# Altium schematic sheet EDLC_DC_DC.SchDoc
size A3; SheetNumber: 2; SheetTotal: 5
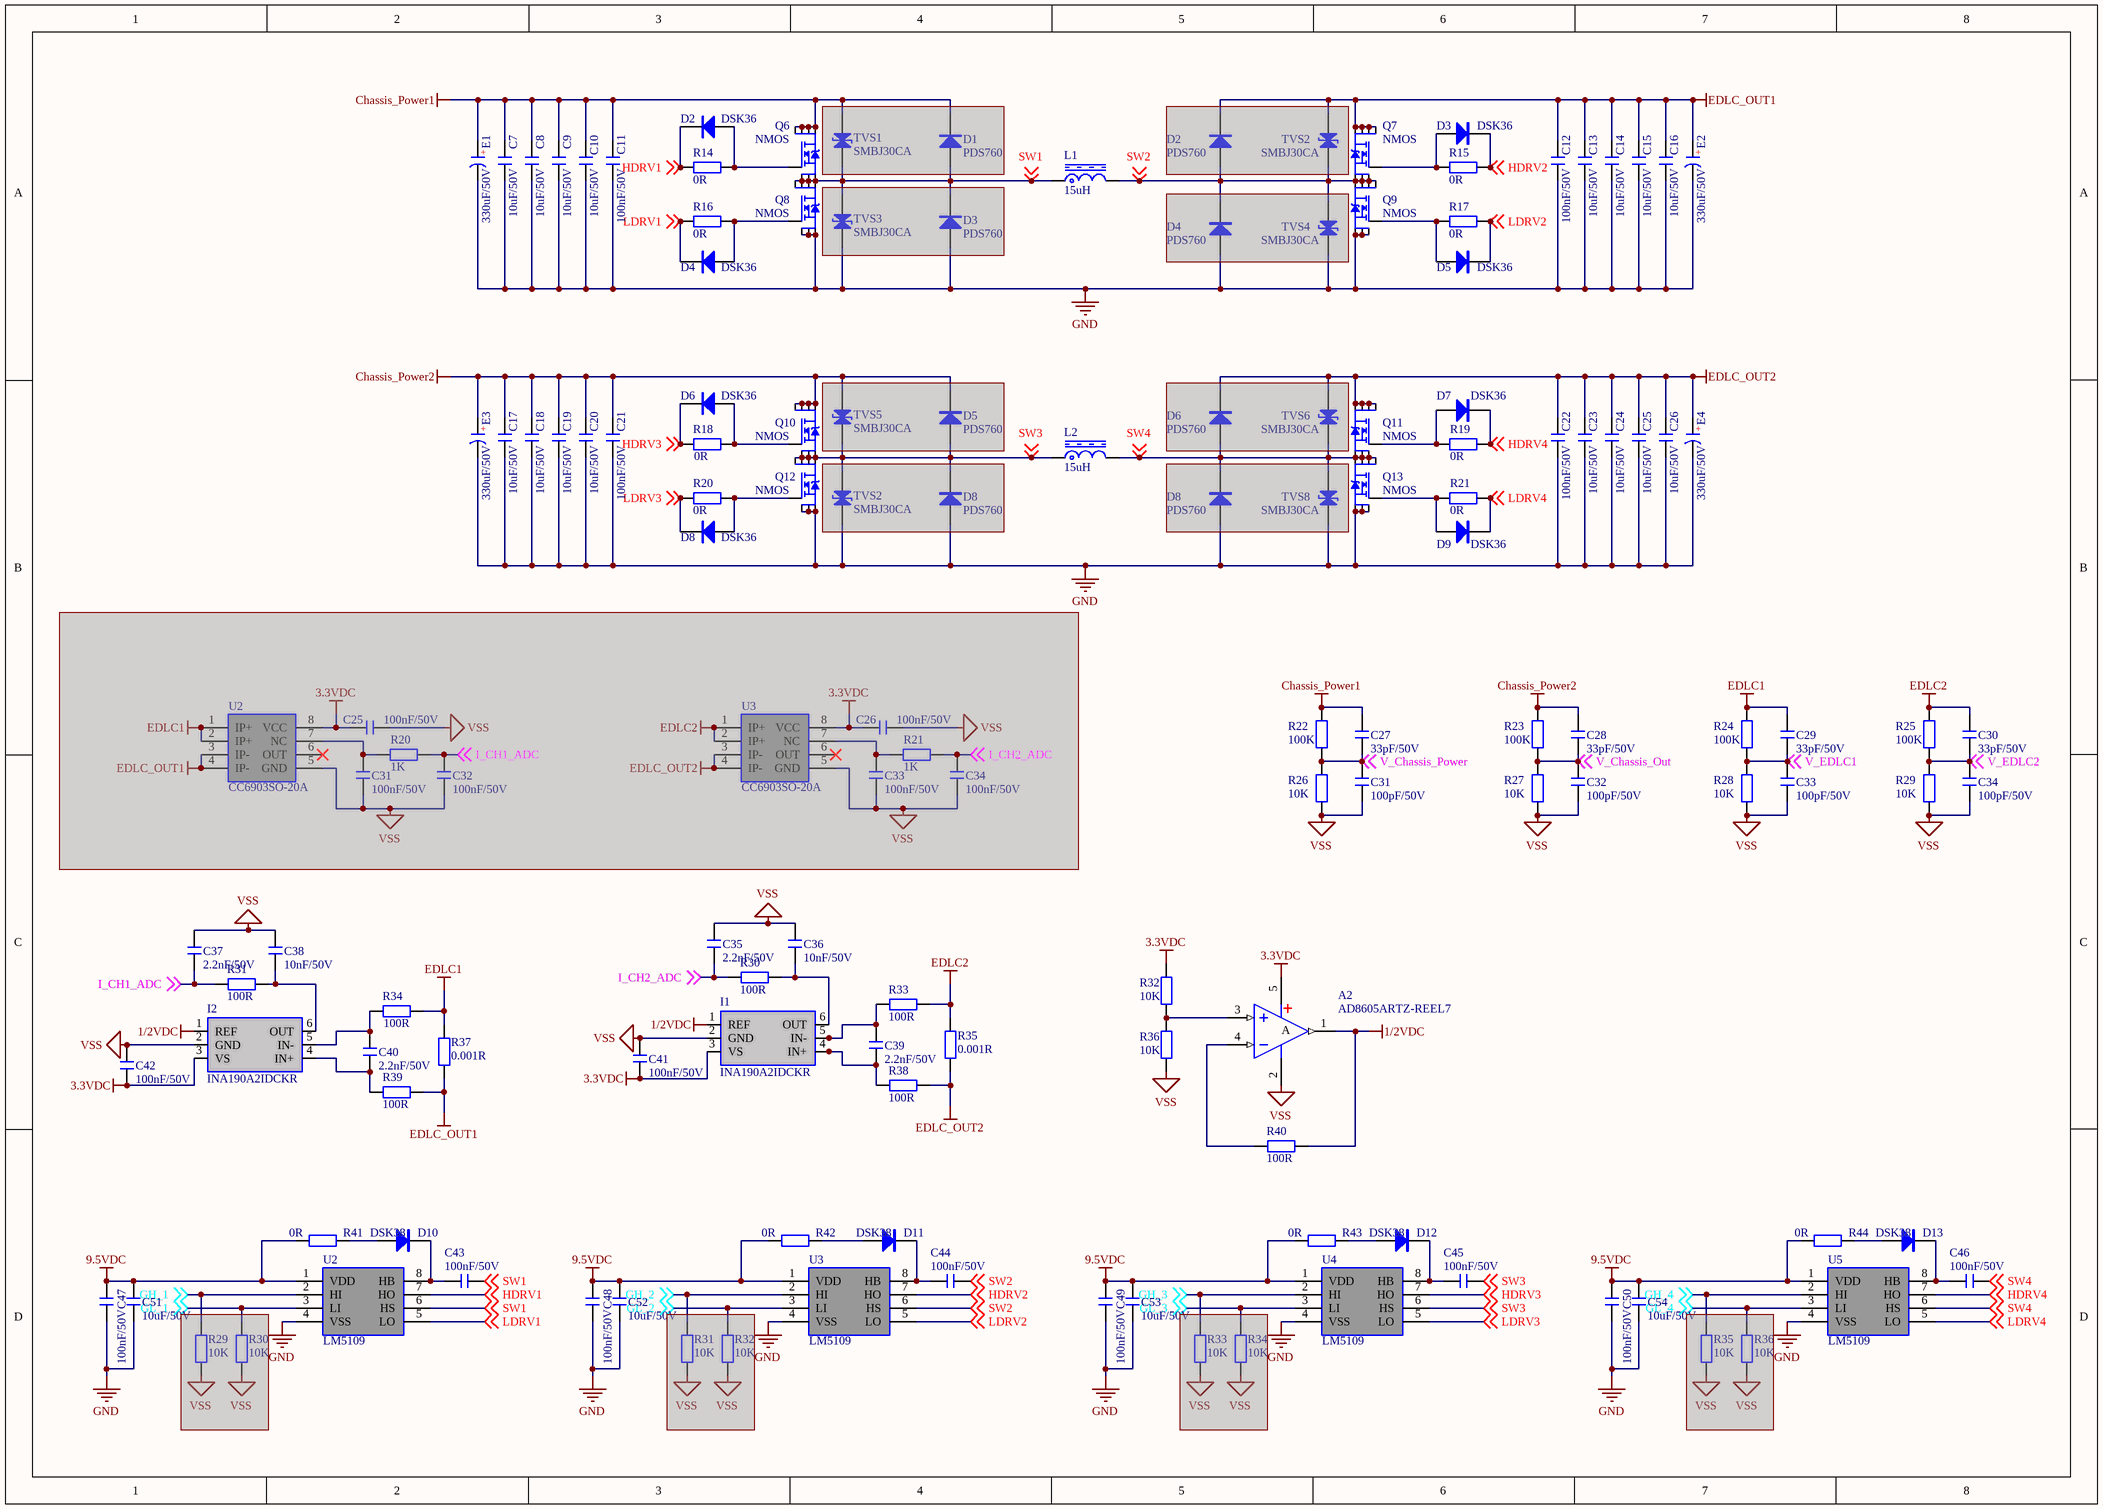
[diagram p0: EDLC_DC_DC.SchDoc]

## Parts
(Parts that share a designator on the sheet are numbered #1, #2 ... from top to bottom, then left to right.)
A2  AD8605ARTZ-REEL7  [SOT23-5N]
C7  10uF/50V  [C 1206_L]
C8  10uF/50V  [C 1206_L]
C9  10uF/50V  [C 1206_L]
C10  10uF/50V  [C 1206_L]
C11  100nF/50V  [C 0603_L]
C12  100nF/50V  [C 0603_L]
C13  10uF/50V  [C 1206_L]
C14  10uF/50V  [C 1206_L]
C15  10uF/50V  [C 1206_L]
C16  10uF/50V  [C 1206_L]
C17  10uF/50V  [C 1206_L]
C18  10uF/50V  [C 1206_L]
C19  10uF/50V  [C 1206_L]
C20  10uF/50V  [C 1206_L]
C21  100nF/50V  [C 0603_L]
C22  100nF/50V  [C 0603_L]
C23  10uF/50V  [C 1206_L]
C24  10uF/50V  [C 1206_L]
C25#1  10uF/50V  [C 1206_L]
C25#2  100nF/50V  [C 0603_L]  (masked out: inside a compile mask, not in the netlist)
C26#1  10uF/50V  [C 1206_L]
C26#2  100nF/50V  [C 0603_L]  (masked out: inside a compile mask, not in the netlist)
C27  33pF/50V  [C 0603_L]
C28  33pF/50V  [C 0603_L]
C29  33pF/50V  [C 0603_L]
C30  33pF/50V  [C 0603_L]
C31#1  100nF/50V  [C 0603_L]  (masked out: inside a compile mask, not in the netlist)
C31#2  100pF/50V  [C 0603_L]
C32#1  100nF/50V  [C 0603_L]  (masked out: inside a compile mask, not in the netlist)
C32#2  100pF/50V  [C 0603_L]
C33#1  100nF/50V  [C 0603_L]  (masked out: inside a compile mask, not in the netlist)
C33#2  100pF/50V  [C 0603_L]
C34#1  100nF/50V  [C 0603_L]  (masked out: inside a compile mask, not in the netlist)
C34#2  100pF/50V  [C 0603_L]
C35  2.2nF/50V  [C 0603_L]
C36  10nF/50V  [C 0603_L]
C37  2.2nF/50V  [C 0603_L]
C38  10nF/50V  [C 0603_L]
C39  2.2nF/50V  [C 0603_L]
C40  2.2nF/50V  [C 0603_L]
C41  100nF/50V  [C 0603_L]
C42  100nF/50V  [C 0603_L]
C43  100nF/50V  [C 0603_L]
C44  100nF/50V  [C 0603_L]
C45  100nF/50V  [C 0603_L]
C46  100nF/50V  [C 0603_L]
C47  100nF/50V  [C 0603_L]
C48  100nF/50V  [C 0603_L]
C49  100nF/50V  [C 0603_L]
C50  100nF/50V  [C 0603_L]
C51  10uF/50V  [C 1206_L]
C52  10uF/50V  [C 1206_L]
C53  10uF/50V  [C 1206_L]
C54  10uF/50V  [C 1206_L]
D1  PDS760  [SMPC]  (masked out: inside a compile mask, not in the netlist)
D2#1  DSK36  [SOD-323]
D2#2  PDS760  [SMPC]  (masked out: inside a compile mask, not in the netlist)
D3#1  DSK36  [SOD-323]
D3#2  PDS760  [SMPC]  (masked out: inside a compile mask, not in the netlist)
D4#1  PDS760  [SMPC]  (masked out: inside a compile mask, not in the netlist)
D4#2  DSK36  [SOD-323]
D5#1  DSK36  [SOD-323]
D5#2  PDS760  [SMPC]  (masked out: inside a compile mask, not in the netlist)
D6#1  DSK36  [SOD-323]
D6#2  PDS760  [SMPC]  (masked out: inside a compile mask, not in the netlist)
D7  DSK36  [SOD-323]
D8#1  PDS760  [SMPC]  (masked out: inside a compile mask, not in the netlist)
D8#2  PDS760  [SMPC]  (masked out: inside a compile mask, not in the netlist)
D8#3  DSK36  [SOD-323]
D9  DSK36  [SOD-323]
D10  DSK38  [SOD-123F]
D11  DSK38  [SOD-123F]
D12  DSK38  [SOD-123F]
D13  DSK38  [SOD-123F]
E1  330uF/50V  [CS 5.0*10*13 - R]
E2  330uF/50V  [CS 5.0*10*13 - R]
E3  330uF/50V  [CS 5.0*10*13 - R]
E4  330uF/50V  [CS 5.0*10*13 - R]
I1  INA190A2IDCKR  [SC-70-6]
I2  INA190A2IDCKR  [SC-70-6]
L1  15uH  [CKST2020-1717]
L2  15uH  [CKST2020-1717]
Q6  NMOS  [DFN5*6-8L]
Q7  NMOS  [DFN5*6-8L]
Q8  NMOS  [DFN5*6-8L]
Q9  NMOS  [DFN5*6-8L]
Q10  NMOS  [DFN5*6-8L]
Q11  NMOS  [DFN5*6-8L]
Q12  NMOS  [DFN5*6-8L]
Q13  NMOS  [DFN5*6-8L]
R14  0R  [R 0603_L]
R15  0R  [R 0603_L]
R16  0R  [R 0603_L]
R17  0R  [R 0603_L]
R18  0R  [R 0603_L]
R19  0R  [R 0603_L]
R20#1  0R  [R 0603_L]
R20#2  1K  [R 0603_L]  (masked out: inside a compile mask, not in the netlist)
R21#1  0R  [R 0603_L]
R21#2  1K  [R 0603_L]  (masked out: inside a compile mask, not in the netlist)
R22  100K  [R 0603-HP_L]
R23  100K  [R 0603-HP_L]
R24  100K  [R 0603-HP_L]
R25  100K  [R 0603-HP_L]
R26  10K  [R 0603-HP_L]
R27  10K  [R 0603-HP_L]
R28  10K  [R 0603-HP_L]
R29#1  10K  [R 0603-HP_L]
R29#2  10K  [R 0603_L]  (masked out: inside a compile mask, not in the netlist)
R30#1  100R  [R 0603_L]
R30#2  10K  [R 0603_L]  (masked out: inside a compile mask, not in the netlist)
R31#1  100R  [R 0603_L]
R31#2  10K  [R 0603_L]  (masked out: inside a compile mask, not in the netlist)
R32#1  10K  [R 0603-HP_L]
R32#2  10K  [R 0603_L]  (masked out: inside a compile mask, not in the netlist)
R33#1  100R  [R 0603_L]
R33#2  10K  [R 0603_L]  (masked out: inside a compile mask, not in the netlist)
R34#1  100R  [R 0603_L]
R34#2  10K  [R 0603_L]  (masked out: inside a compile mask, not in the netlist)
R35#1  0.001R  [R 2512_M]
R35#2  10K  [R 0603_L]  (masked out: inside a compile mask, not in the netlist)
R36#1  10K  [R 0603-HP_L]
R36#2  10K  [R 0603_L]  (masked out: inside a compile mask, not in the netlist)
R37  0.001R  [R 2512_M]
R38  100R  [R 0603_L]
R39  100R  [R 0603_L]
R40  100R  [R 0603_L]
R41  0R  [R 0603_L]
R42  0R  [R 0603_L]
R43  0R  [R 0603_L]
R44  0R  [R 0603_L]
TVS1  SMBJ30CA  [SMB]  (masked out: inside a compile mask, not in the netlist)
TVS2#1  SMBJ30CA  [SMB]  (masked out: inside a compile mask, not in the netlist)
TVS2#2  SMBJ30CA  [SMB]  (masked out: inside a compile mask, not in the netlist)
TVS3  SMBJ30CA  [SMB]  (masked out: inside a compile mask, not in the netlist)
TVS4  SMBJ30CA  [SMB]  (masked out: inside a compile mask, not in the netlist)
TVS5  SMBJ30CA  [SMB]  (masked out: inside a compile mask, not in the netlist)
TVS6  SMBJ30CA  [SMB]  (masked out: inside a compile mask, not in the netlist)
TVS8  SMBJ30CA  [SMB]  (masked out: inside a compile mask, not in the netlist)
U2#1  CC6903SO-20A  [SOP8_L]  (masked out: inside a compile mask, not in the netlist)
U2#2  LM5109  [SOP8_L]
U3#1  CC6903SO-20A  [SOP8_L]  (masked out: inside a compile mask, not in the netlist)
U3#2  LM5109  [SOP8_L]
U4  LM5109  [SOP8_L]
U5  LM5109  [SOP8_L]

## Nets
1/2VDC: A2.1(OUT) I1.1(REF) I2.1(REF) R40.2
3.3VDC: A2.5(V+) C41.2 C42.2 I1.3(VS) I2.3(VS) R32#1.2
9.5VDC: C47.2 C48.2 C49.2 C50.2 C51.2 C52.2 C53.2 C54.2 R41.1 R42.1 R43.1 R44.1 U2#2.1(VDD) U3#2.1(VDD) U4.1(VDD) U5.1(VDD)
Chassis_Power1: C7.1 C8.1 C9.1 C10.1 C11.1 C27.1 E1.1(A) Q6.5(D) Q6.6(D) Q6.7(D) Q6.8(D) R22.2
Chassis_Power2: C17.1 C18.1 C19.1 C20.1 C21.1 C28.1 E3.1(A) Q10.5(D) Q10.6(D) Q10.7(D) Q10.8(D) R23.2
EDLC1: C29.1 R24.2 R34#1.2 R37.1
EDLC2: C30.1 R25.2 R33#1.2 R35#1.1
EDLC_OUT1: C12.1 C13.1 C14.1 C15.1 C16.1 E2.1(A) Q7.5(D) Q7.6(D) Q7.7(D) Q7.8(D) R37.2 R39.2
EDLC_OUT2: C22.1 C23.1 C24.1 C25#1.1 C26#1.1 E4.1(A) Q11.5(D) Q11.6(D) Q11.7(D) Q11.8(D) R35#1.2 R38.2
GND: C7.2 C8.2 C9.2 C10.2 C11.2 C12.2 C13.2 C14.2 C15.2 C16.2 C17.2 C18.2 C19.2 C20.2 C21.2 C22.2 C23.2 C24.2 C25#1.2 C26#1.2 C47.1 C48.1 C49.1 C50.1 C51.1 C52.1 C53.1 C54.1 E1.2(K) E2.2(K) E3.2(K) E4.2(K) Q8.1(S) Q8.2(S) Q8.3(S) Q9.1(S) Q9.2(S) Q9.3(S) Q12.1(S) Q12.2(S) Q12.3(S) Q13.1(S) Q13.2(S) Q13.3(S) U2#2.4(VSS) U3#2.4(VSS) U4.4(VSS) U5.4(VSS)
VSS: A2.2(V-) C31#2.2 C32#2.2 C33#2.2 C34#2.2 C35.2 C36.2 C37.2 C38.2 C41.1 C42.1 I1.2(GND) I2.2(GND) R26.1 R27.1 R28.1 R29#1.1 R36#1.1
GH_1: U2#2.2(HI) ; off-sheet GH_1
GH_2: U3#2.2(HI) ; off-sheet GH_2
GH_3: U4.2(HI) ; off-sheet GH_3
GH_4: U5.2(HI) ; off-sheet GH_4
GL_1: U2#2.3(LI) ; off-sheet GL_1
GL_2: U3#2.3(LI) ; off-sheet GL_2
GL_3: U4.3(LI) ; off-sheet GL_3
GL_4: U5.3(LI) ; off-sheet GL_4
HDRV1: D2#1.2(K) R14.1 U2#2.7(HO) ; off-sheet HDRV1
HDRV2: D3#1.2(K) R15.2 U3#2.7(HO) ; off-sheet HDRV2
HDRV3: D6#1.2(K) R18.1 U4.7(HO) ; off-sheet HDRV3
HDRV4: D7.2(K) R19.2 U5.7(HO) ; off-sheet HDRV4
I_CH1_ADC: C37.1 R31#1.2 ; off-sheet I_CH1_ADC
I_CH2_ADC: C35.1 R30#1.2 ; off-sheet I_CH2_ADC
LDRV1: D4#2.2(K) R16.1 U2#2.5(LO) ; off-sheet LDRV1
LDRV2: D5#1.2(K) R17.2 U3#2.5(LO) ; off-sheet LDRV2
LDRV3: D8#3.2(K) R20#1.1 U4.5(LO) ; off-sheet LDRV3
LDRV4: D9.2(K) R21#1.2 U5.5(LO) ; off-sheet LDRV4
SW1: C43.2 L1.1 Q6.1(S) Q6.2(S) Q6.3(S) Q8.5(D) Q8.6(D) Q8.7(D) Q8.8(D) U2#2.6(HS) ; off-sheet SW1
SW2: C44.2 L1.2 Q7.1(S) Q7.2(S) Q7.3(S) Q9.5(D) Q9.6(D) Q9.7(D) Q9.8(D) U3#2.6(HS) ; off-sheet SW2
SW3: C45.2 L2.1 Q10.1(S) Q10.2(S) Q10.3(S) Q12.5(D) Q12.6(D) Q12.7(D) Q12.8(D) U4.6(HS) ; off-sheet SW3
SW4: C46.2 L2.2 Q11.1(S) Q11.2(S) Q11.3(S) Q13.5(D) Q13.6(D) Q13.7(D) Q13.8(D) U5.6(HS) ; off-sheet SW4
V_Chassis_Out: C28.2 C32#2.1 R23.1 R27.2 ; off-sheet V_Chassis_Out
V_Chassis_Power: C27.2 C31#2.1 R22.1 R26.2 ; off-sheet V_Chassis_Power
V_EDLC1: C29.2 C33#2.1 R24.1 R28.2 ; off-sheet V_EDLC1
V_EDLC2: C30.2 C34#2.1 R25.1 R29#1.2 ; off-sheet V_EDLC2
NetA2_3: A2.3(IN+) R32#1.1 R36#1.2
NetA2_4: A2.4(IN-) R40.1
NetC36_1: C36.1 I1.6(OUT) R30#1.1
NetC38_1: C38.1 I2.6(OUT) R31#1.1
NetC39_1: C39.1 I1.5(IN-) R33#1.1
NetC39_2: C39.2 I1.4(IN+) R38.1
NetC40_1: C40.1 I2.5(IN-) R34#1.1
NetC40_2: C40.2 I2.4(IN+) R39.1
NetC43_1: C43.1 D10.2(K) U2#2.8(HB)
NetC44_1: C44.1 D11.2(K) U3#2.8(HB)
NetC45_1: C45.1 D12.2(K) U4.8(HB)
NetC46_1: C46.1 D13.2(K) U5.8(HB)
NetD2#1_1: D2#1.1(A) Q6.4(G) R14.2
NetD3#1_1: D3#1.1(A) Q7.4(G) R15.1
NetD4#2_1: D4#2.1(A) Q8.4(G) R16.2
NetD5#1_1: D5#1.1(A) Q9.4(G) R17.1
NetD6#1_1: D6#1.1(A) Q10.4(G) R18.2
NetD7_1: D7.1(A) Q11.4(G) R19.1
NetD8#3_1: D8#3.1(A) Q12.4(G) R20#1.2
NetD9_1: D9.1(A) Q13.4(G) R21#1.1
NetD10_1: D10.1(A) R41.2
NetD11_1: D11.1(A) R42.2
NetD12_1: D12.1(A) R43.2
NetD13_1: D13.1(A) R44.2

## Notes on the sheet
- (in symbol AD8605ARTZ-REEL7) A
- (in symbol C-CS) +

## Library data of the parts
A2 = AD8605ARTZ-REEL7: 高精度低噪声CMOS轨对轨输入/输出运算放大器
C7-C24 C25#1 C25#2 C26#1 C26#2 C27-C30 C31#1 C31#2 C32#1 C32#2 C33#1 C33#2 C34#1 C34#2 C35-C54 = C: 无极性贴片电容; 版权归属: 源创客; BOM名称: 无极性贴片电容; 学习资源: www.ooocke.com
D1 D2#2 D3#2 D4#1 D5#2 D6#2 D8#1 D8#2 = SS76: 肖特基二极管; 版权归属: 源创客; BOM名称: 肖特基二极管; 学习资源: www.ooocke.com
D2#1 D3#1 D4#2 D5#1 D6#1 D7 D8#3 D9 = 1N4148: 高速开关二极管; 版权归属: 源创客; BOM名称: 高速开关二极管; 学习资源: www.ooocke.com
D10-D13 = SS34: 肖特基二极管; 版权归属: 源创客; 属性: 40V/3A; BOM名称: 肖特基二极管; 学习资源: www.ooocke.com
E1-E4 = C-CS: 直插固态电容; 版权归属: 源创客; BOM名称: 直插固态电容; 学习资源: www.ooocke.com
I1 I2 = INA190A2IDCKR: 电流感应放大器 40V
L1 L2 = L-HP: 一体成型电感; BOM名称: 功率屏蔽电感; 版权归属: 源创客; 学习资源: www.ooocke.com
Q6-Q13 = NMOS_DFN: DFN封装N沟道场效应管; BOM名称: P沟道场效应管; 版权归属: 源创客; 学习资源: www.ooocke.com
R14-R19 R20#1 R20#2 R21#1 R21#2 R29#2 R30#1 R30#2 R31#1 R31#2 R32#2 R33#1 R33#2 R34#1 R34#2 R35#1 R35#2 R36#2 R37-R44 = R: 贴片电阻; 版权归属: 源创客; BOM名称: 贴片电阻; 学习资源: www.ooocke.com
R22-R28 R29#1 R32#1 R36#1 = R-Precision: 精密贴片电阻; BOM名称: 精密电阻; 版权归属: 源创客; 学习资源: www.ooocke.com
TVS1 TVS2#1 TVS2#2 TVS3-TVS6 TVS8 = TVS: 瞬态电压抑制二极管; 版权归属: 源创客; BOM名称: 瞬态电压抑制二极管; 学习资源: www.ooocke.com
U2#1 U3#1 = CC6903: 10A/20A/30A霍尔电流传感器
U2#2 U3#2 U4 U5 = LM5109: 半桥驱动